# Altium schematic sheet MSP432.SchDoc
size Letter
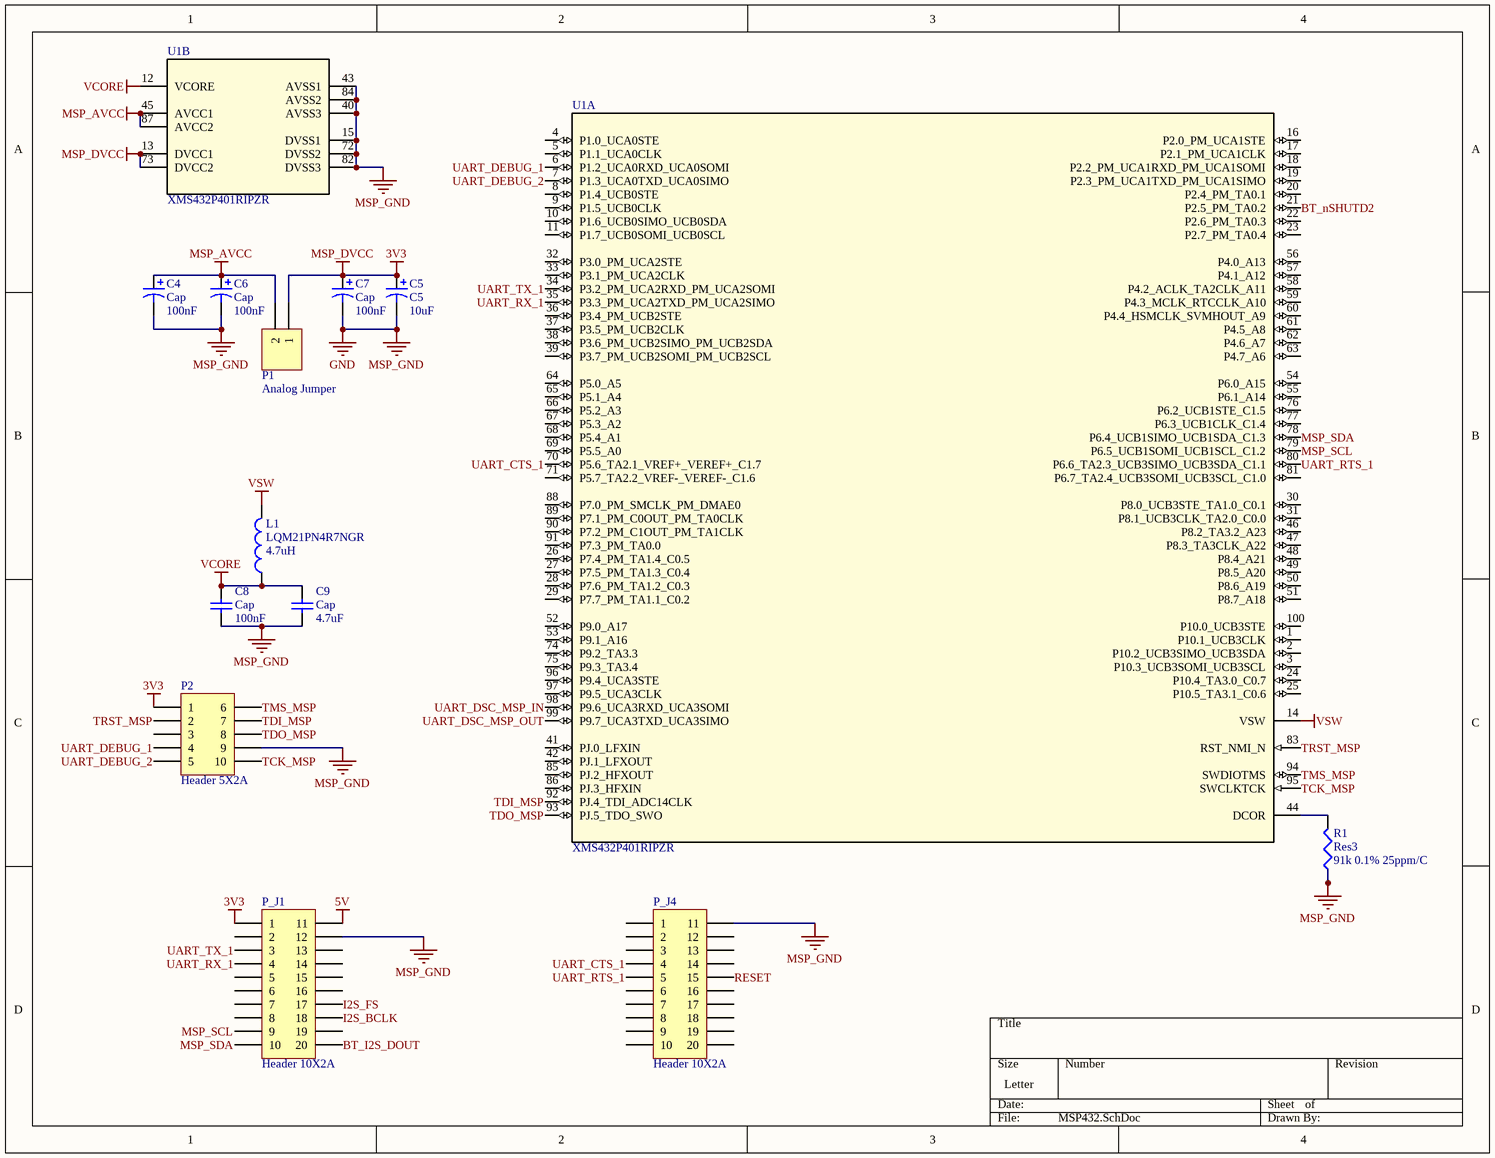
[diagram p0: MSP432.SchDoc]

## Parts
C4  Cap  value 100nF  [C0805]
C5  C5  value 10uF  [C0805]
C6  Cap  value 100nF  [C0805]
C7  Cap  value 100nF  [C0805]
C8  Cap  value 100nF  [C0805]
C9  Cap  value 4.7uF  [C0805]
L1  LQM21PN4R7NGR  value 4.7uH  [6-0805_N]
P1  Analog Jumper  [HDR1X2]
P2  Header 5X2A  [HDR2X5_CEN]
P_J1  Header 10X2A  [HDR2X10_CEN]
P_J4  Header 10X2A  [HDR2X10_CEN]
R1  Res3  value 91k 0.1% 25ppm/C  [14-1210]
U1  XMS432P401RIPZR  [PZ0100A_N]  (parts A,B of 2)

## Nets
3V3: C5.1 C7.1 P1.1 P2.1 P_J1.1 U1.13(DVCC1) U1.73(DVCC2)  [also labelled MSP_DVCC]
5V: P_J1.11
GND: C4.2 C5.2 C6.2 C7.2 C8.1 C9.2 P2.9 P_J1.12 P_J4.11 R1.1 U1.15(DVSS1) U1.40(AVSS3) U1.43(AVSS1) U1.72(DVSS2) U1.82(DVSS3) U1.84(AVSS2)  [also labelled MSP_GND]
MSP_AVCC: C4.1 C6.1 P1.2 U1.45(AVCC1) U1.87(AVCC2)
VCORE: C8.2 C9.1 L1.1 U1.12(VCORE)
VSW: L1.2 U1.14(VSW)
BT_I2S_DOUT: P_J1.20
BT_nSHUTD2: U1.21(P2.5_PM_TA0.2)
I2S_BCLK: P_J1.18
I2S_FS: P_J1.17
MSP_SCL: P_J1.9 U1.79(P6.5_UCB1SOMI_UCB1SCL_C1.2)
MSP_SDA: P_J1.10 U1.78(P6.4_UCB1SIMO_UCB1SDA_C1.3)
RESET: P_J4.15
TCK_MSP: P2.10 U1.95(SWCLKTCK)
TDI_MSP: P2.7 U1.92(PJ.4_TDI_ADC14CLK)
TDO_MSP: P2.8 U1.93(PJ.5_TDO_SWO)
TMS_MSP: P2.6 U1.94(SWDIOTMS)
TRST_MSP: P2.2 U1.83(RST_NMI_N)
UART_CTS_1: P_J4.4 U1.70(P5.6_TA2.1_VREF+_VEREF+_C1.7)
UART_DEBUG_1: P2.4 U1.6(P1.2_UCA0RXD_UCA0SOMI)
UART_DEBUG_2: P2.5 U1.7(P1.3_UCA0TXD_UCA0SIMO)
UART_DSC_MSP_IN: U1.98(P9.6_UCA3RXD_UCA3SOMI)
UART_DSC_MSP_OUT: U1.99(P9.7_UCA3TXD_UCA3SIMO)
UART_RTS_1: P_J4.5 U1.80(P6.6_TA2.3_UCB3SIMO_UCB3SDA_C1.1)
UART_RX_1: P_J1.4 U1.35(P3.3_PM_UCA2TXD_PM_UCA2SIMO)
UART_TX_1: P_J1.3 U1.34(P3.2_PM_UCA2RXD_PM_UCA2SOMI)
NetR1_2: R1.2 U1.44(DCOR)

Not connected (* = marked no-connect by the designer): P2 3; P_J1 2 5 6 7 8 13 14 15 16 19; P_J4 1 2 3 6 7 8 9 10 12 13 14 16 17 18 19 20; U1 1(P10.1_UCB3CLK) 2(P10.2_UCB3SIMO_UCB3SDA) 3(P10.3_UCB3SOMI_UCB3SCL) 4(P1.0_UCA0STE) 5(P1.1_UCA0CLK) 8(P1.4_UCB0STE) 9(P1.5_UCB0CLK) 10(P1.6_UCB0SIMO_UCB0SDA) 11(P1.7_UCB0SOMI_UCB0SCL) 16(P2.0_PM_UCA1STE) 17(P2.1_PM_UCA1CLK) 18(P2.2_PM_UCA1RXD_PM_UCA1SOMI) 19(P2.3_PM_UCA1TXD_PM_UCA1SIMO) 20(P2.4_PM_TA0.1) 22(P2.6_PM_TA0.3) 23(P2.7_PM_TA0.4) 24(P10.4_TA3.0_C0.7) 25(P10.5_TA3.1_C0.6) 26(P7.4_PM_TA1.4_C0.5) 27(P7.5_PM_TA1.3_C0.4) 28(P7.6_PM_TA1.2_C0.3) 29(P7.7_PM_TA1.1_C0.2) 30(P8.0_UCB3STE_TA1.0_C0.1) 31(P8.1_UCB3CLK_TA2.0_C0.0) 32(P3.0_PM_UCA2STE) 33(P3.1_PM_UCA2CLK) 36(P3.4_PM_UCB2STE) 37(P3.5_PM_UCB2CLK) 38(P3.6_PM_UCB2SIMO_PM_UCB2SDA) 39(P3.7_PM_UCB2SOMI_PM_UCB2SCL) 41(PJ.0_LFXIN) 42(PJ.1_LFXOUT) 46(P8.2_TA3.2_A23) 47(P8.3_TA3CLK_A22) 48(P8.4_A21) 49(P8.5_A20) 50(P8.6_A19) 51(P8.7_A18) 52(P9.0_A17) 53(P9.1_A16) 54(P6.0_A15) 55(P6.1_A14) 56(P4.0_A13) 57(P4.1_A12) 58(P4.2_ACLK_TA2CLK_A11) 59(P4.3_MCLK_RTCCLK_A10) 60(P4.4_HSMCLK_SVMHOUT_A9) 61(P4.5_A8) 62(P4.6_A7) 63(P4.7_A6) 64(P5.0_A5) 65(P5.1_A4) 66(P5.2_A3) 67(P5.3_A2) 68(P5.4_A1) 69(P5.5_A0) 71(P5.7_TA2.2_VREF-_VEREF-_C1.6) 74(P9.2_TA3.3) 75(P9.3_TA3.4) 76(P6.2_UCB1STE_C1.5) 77(P6.3_UCB1CLK_C1.4) 81(P6.7_TA2.4_UCB3SOMI_UCB3SCL_C1.0) 85(PJ.2_HFXOUT) 86(PJ.3_HFXIN) 88(P7.0_PM_SMCLK_PM_DMAE0) 89(P7.1_PM_C0OUT_PM_TA0CLK) 90(P7.2_PM_C1OUT_PM_TA1CLK) 91(P7.3_PM_TA0.0) 96(P9.4_UCA3STE) 97(P9.5_UCA3CLK) 100(P10.0_UCB3STE)

## Library data of the parts
C4-C7 = Cap Pol3: Polarized Capacitor (Surface Mount); Published: 8-Jun-2000; LatestRevisionDate: 29-May-2009; LatestRevisionNote: IPC-7351 Footprint Added.; PackageReference: C0805; Publisher: Altium Limited; PackageDescription: Chip Capacitor
C8 C9 = Cap Semi: Capacitor (Semiconductor SIM Model); Published: 8-Jun-2000; LatestRevisionDate: 29-May-2009; LatestRevisionNote: IPC-7351 Footprint Added.; PackageReference: C1206; Publisher: Altium Limited; PackageDescription: Chip Capacitor
L1 = Inductor: Code_IEC: 1005; Published: 8-Jun-2000; LatestRevisionDate: 29-May-2009; LatestRevisionNote: IPC-7351 Footprint Added.; PackageReference: 0402-A; Publisher: Altium Limited; PackageDescription: Chip Inductor; Code_JEITA: 0402
P1 = Header 2: Header, 2-Pin; LatestRevisionDate: 17-Jul-2002; LatestRevisionNote: Re-released for DXP Platform.; Publisher: Altium Limited
P2 = Header 5X2A: Header, 5-Pin, Dual row; LatestRevisionDate: 17-Jul-2002; LatestRevisionNote: Re-released for DXP Platform.; Publisher: Altium Limited
P_J1 P_J4 = Header 10X2A: Header, 10-Pin, Dual row; LatestRevisionDate: 17-Jul-2002; LatestRevisionNote: Re-released for DXP Platform.; Publisher: Altium Limited
R1 = Res3: Resistor; Published: 8-Jun-2000; LatestRevisionDate: 29-May-2009; LatestRevisionNote: IPC-7351 Footprint Added.; PackageReference: J1-0603; Publisher: Altium Limited; PackageDescription: Chip Resistor
U1 = XMS432P401RIPZR: Imported; Manufacturer: Texas Instruments; CompType: IC; PIN_COUNT: 100; PartNumber: XMS432P401RIPZR; PackageReference: PZ0100A; MountType: SMT; RefDes: RefDes; TYPE: TYPE; Value: Value